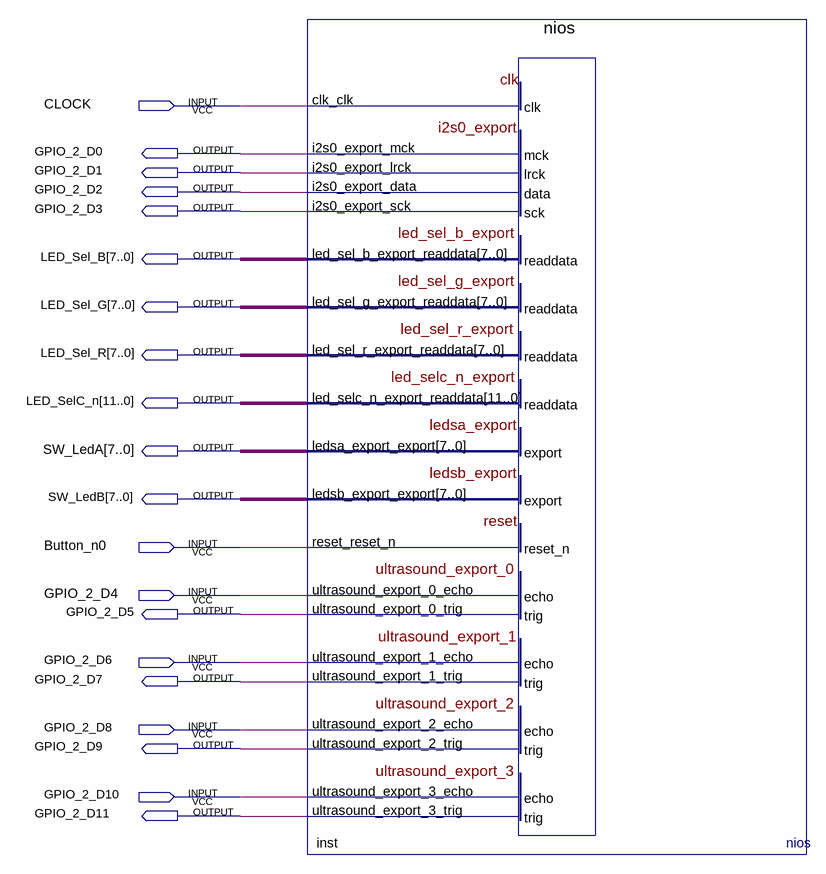
[diagram p0: schematic sheet]
// Quartus schematic ultrasonic_theremin.bdf as structural Verilog: 1 symbols, 20 pins
module ultrasonic_theremin (
  input  CLOCK,
  input  Button_n0,
  input  GPIO_2_D4,
  input  GPIO_2_D6,
  input  GPIO_2_D8,
  input  GPIO_2_D10,
  output GPIO_2_D0,
  output GPIO_2_D1,
  output GPIO_2_D2,
  output GPIO_2_D3,
  output [7:0] LED_Sel_B,
  output [7:0] LED_Sel_G,
  output [7:0] LED_Sel_R,
  output [11:0] LED_SelC_n,
  output [7:0] SW_LedA,
  output [7:0] SW_LedB,
  output GPIO_2_D5,
  output GPIO_2_D7,
  output GPIO_2_D9,
  output GPIO_2_D11
);

  nios inst (
    .clk_clk(CLOCK), .reset_reset_n(Button_n0), .ultrasound_export_0_echo(GPIO_2_D4),
    .ultrasound_export_1_echo(GPIO_2_D6), .ultrasound_export_2_echo(GPIO_2_D8),
    .ultrasound_export_3_echo(GPIO_2_D10), .i2s0_export_mck(GPIO_2_D0), .i2s0_export_lrck(GPIO_2_D1),
    .i2s0_export_data(GPIO_2_D2), .i2s0_export_sck(GPIO_2_D3), .led_sel_b_export_readdata(LED_Sel_B),
    .led_sel_g_export_readdata(LED_Sel_G), .led_sel_r_export_readdata(LED_Sel_R),
    .led_selc_n_export_readdata(LED_SelC_n), .ledsa_export_export(SW_LedA), .ledsb_export_export(SW_LedB),
    .ultrasound_export_0_trig(GPIO_2_D5), .ultrasound_export_1_trig(GPIO_2_D7),
    .ultrasound_export_2_trig(GPIO_2_D9), .ultrasound_export_3_trig(GPIO_2_D11));
endmodule
